# Altium schematic sheet B2B_Connectors.SchDoc: B2B Connector
size A4; Organization: Trenz Electronic GmbH; DocumentNumber: TE0706; Revision: 02; SheetNumber: 2; SheetTotal: 10; Date: 2016-06-28; Author: Vitali Tsiukala; DrawnBy: Vitali Tsiukala; Engineer: Vitali Tsiukala; PageSetup: Record=PageOptions|CenterHorizontal=True|CenterVertical=True|PrintScale=0.97|XCorrection=1.00|YCorrection=1.00|PrintKind=0|BorderSize=5000000|LeftOffset=0|BottomOffset=0|Orientation=2|PaperLength=2970|PaperWidth=2100|Scale=100|PaperSource=7|PrintQuality=600|MediaType=1|DitherType=10|PrintScaleMode=1|PaperKind=A4|PaperIndex=9
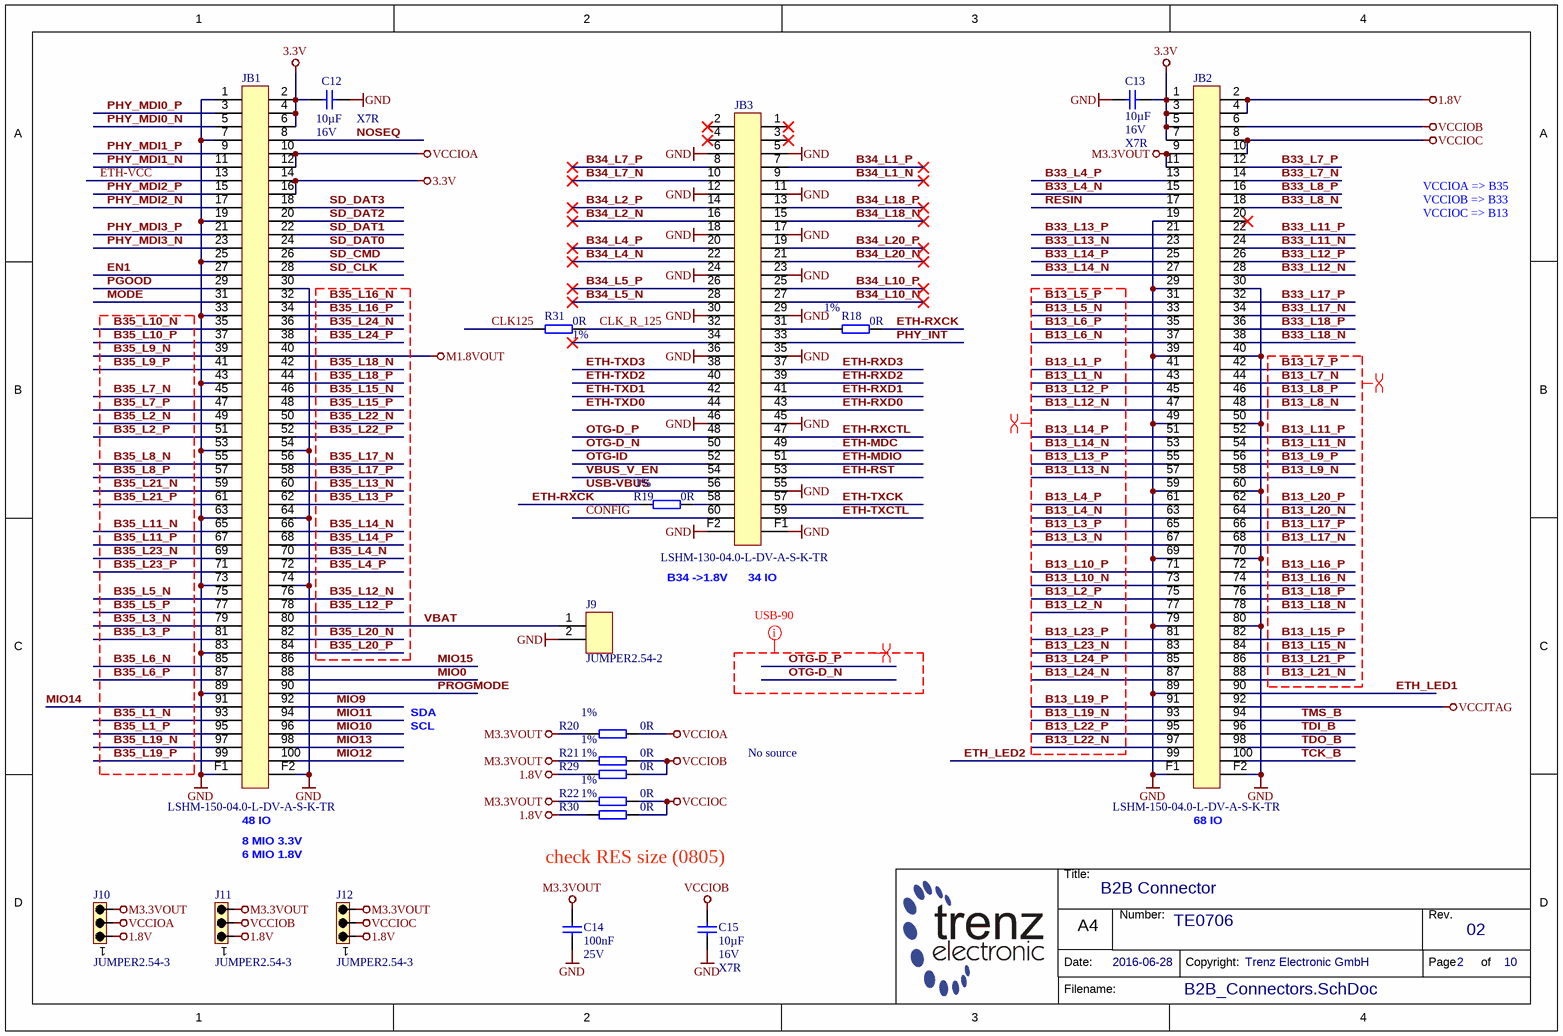
[diagram p0: B2B_Connectors.SchDoc]

## Parts
C12  10µF  Voltage: 16V  Technology: X7R  [CAPC2012X135N]
C13  10µF  Voltage: 16V  Technology: X7R  [CAPC2012X135N]
C14  100nF  Voltage: 25V  [CAPC1005X55N]
C15  10µF  Voltage: 16V  Technology: X7R  [CAPC2012X135N]
J9  JUMPER2.54-2  [JUMPER2_54-2]
J10  JUMPER2.54-3  [JUMPER2_54-3]
J11  JUMPER2.54-3  [JUMPER2_54-3]
J12  JUMPER2.54-3  [JUMPER2_54-3]
JB1  LSHM-150-04.0-L-DV-A-S-K-TR  [LSHM-150-XXX-X-DV-A-X]
JB2  LSHM-150-04.0-L-DV-A-S-K-TR  [LSHM-150-XXX-X-DV-A-X]
JB3  LSHM-130-04.0-L-DV-A-S-K-TR  [LSHM-130-04.0-x-DV-A-S-K-TR]
R18  0R  Tolerance: 1%  [RESC1005X40N]
R19  0R  Tolerance: 1%  [RESC1005X40N]
R20  0R  Tolerance: 1%  [RESC2012X60N]
R21  0R  Tolerance: 1%  [RESC2012X60N]
R22  0R  Tolerance: 1%  [RESC2012X60N]
R29  0R  Tolerance: 1%  [RESC2012X60N]
R30  0R  Tolerance: 1%  [RESC2012X60N]
R31  0R  Tolerance: 1%  [RESC1005X40N]

## Nets
1.8V: J10.1 J11.1 J12.1 JB2.2 JB2.4 R29.1 R30.1
3.3V: C12.2 C13.2 JB1.2 JB1.4 JB1.6 JB1.14 JB1.16 JB2.1 JB2.3 JB2.5 JB2.7
GND: C12.1 C13.1 C14.2 C15.1 J9.2 JB1.1 JB1.7 JB1.19 JB1.25 JB1.30 JB1.33 JB1.43 JB1.53 JB1.54 JB1.63 JB1.64 JB1.73 JB1.74 JB1.83 JB1.89 JB1.F1(Shield) JB1.F2(Shield) JB2.19 JB2.29 JB2.30 JB2.39 JB2.40 JB2.49 JB2.50 JB2.59 JB2.60 JB2.69 JB2.70 JB2.79 JB2.80 JB2.89 JB2.F1(Shield) JB2.F2(Shield) JB3.5 JB3.6 JB3.11 JB3.12 JB3.17 JB3.18 JB3.23 JB3.24 JB3.29 JB3.30 JB3.35 JB3.36 JB3.45 JB3.46 JB3.55 JB3.F1(Shield) JB3.F2(Shield)
M1.8VOUT: JB1.40
M3.3VOUT: C14.1 J10.3 J11.3 J12.3 JB2.9 JB2.11 R20.1 R21.1 R22.1
VCCIOA: J10.2 JB1.10 JB1.12 R20.2
VCCIOB: C15.2 J11.2 JB2.6 R21.2 R29.2
VCCIOC: J12.2 JB2.8 JB2.10 R22.2 R30.2
VCCJTAG: JB2.92
B13_L1_N: JB2.43
B13_L1_P: JB2.41
B13_L2_N: JB2.77
B13_L2_P: JB2.75
B13_L3_N: JB2.67
B13_L3_P: JB2.65
B13_L4_N: JB2.63
B13_L4_P: JB2.61
B13_L5_N: JB2.33
B13_L5_P: JB2.31
B13_L6_N: JB2.37
B13_L6_P: JB2.35
B13_L7_N: JB2.44
B13_L7_P: JB2.42
B13_L8_N: JB2.48
B13_L8_P: JB2.46
B13_L9_N: JB2.58
B13_L9_P: JB2.56
B13_L10_N: JB2.73
B13_L10_P: JB2.71
B13_L11_N: JB2.54
B13_L11_P: JB2.52
B13_L12_N: JB2.47
B13_L12_P: JB2.45
B13_L13_N: JB2.57
B13_L13_P: JB2.55
B13_L14_N: JB2.53
B13_L14_P: JB2.51
B13_L15_N: JB2.84
B13_L15_P: JB2.82
B13_L16_N: JB2.74
B13_L16_P: JB2.72
B13_L17_N: JB2.68
B13_L17_P: JB2.66
B13_L18_N: JB2.78
B13_L18_P: JB2.76
B13_L19_N: JB2.93
B13_L19_P: JB2.91
B13_L20_N: JB2.64
B13_L20_P: JB2.62
B13_L21_N: JB2.88
B13_L21_P: JB2.86
B13_L22_N: JB2.97
B13_L22_P: JB2.95
B13_L23_N: JB2.83
B13_L23_P: JB2.81
B13_L24_N: JB2.87
B13_L24_P: JB2.85
B33_L4_N: JB2.15
B33_L4_P: JB2.13
B33_L7_N: JB2.14
B33_L7_P: JB2.12
B33_L8_N: JB2.18
B33_L8_P: JB2.16
B33_L11_N: JB2.24
B33_L11_P: JB2.22
B33_L12_N: JB2.28
B33_L12_P: JB2.26
B33_L13_N: JB2.23
B33_L13_P: JB2.21
B33_L14_N: JB2.27
B33_L14_P: JB2.25
B33_L17_N: JB2.34
B33_L17_P: JB2.32
B33_L18_N: JB2.38
B33_L18_P: JB2.36
B34_L1_N: JB3.9
B34_L1_P: JB3.7
B34_L2_N: JB3.16
B34_L2_P: JB3.14
B34_L4_N: JB3.22
B34_L4_P: JB3.20
B34_L5_N: JB3.28
B34_L5_P: JB3.26
B34_L7_N: JB3.10
B34_L7_P: JB3.8
B34_L10_N: JB3.27
B34_L10_P: JB3.25
B34_L18_N: JB3.15
B34_L18_P: JB3.13
B34_L20_N: JB3.21
B34_L20_P: JB3.19
B35_L1_N: JB1.93
B35_L1_P: JB1.95
B35_L2_N: JB1.49
B35_L2_P: JB1.51
B35_L3_N: JB1.79
B35_L3_P: JB1.81
B35_L4_N: JB1.70
B35_L4_P: JB1.72
B35_L5_N: JB1.75
B35_L5_P: JB1.77
B35_L6_N: JB1.85
B35_L6_P: JB1.87
B35_L7_N: JB1.45
B35_L7_P: JB1.47
B35_L8_N: JB1.55
B35_L8_P: JB1.57
B35_L9_N: JB1.39
B35_L9_P: JB1.41
B35_L10_N: JB1.35
B35_L10_P: JB1.37
B35_L11_N: JB1.65
B35_L11_P: JB1.67
B35_L12_N: JB1.76
B35_L12_P: JB1.78
B35_L13_N: JB1.60
B35_L13_P: JB1.62
B35_L14_N: JB1.66
B35_L14_P: JB1.68
B35_L15_N: JB1.46
B35_L15_P: JB1.48
B35_L16_N: JB1.32
B35_L16_P: JB1.34
B35_L17_N: JB1.56
B35_L17_P: JB1.58
B35_L18_N: JB1.42
B35_L18_P: JB1.44
B35_L19_N: JB1.97
B35_L19_P: JB1.99
B35_L20_N: JB1.82
B35_L20_P: JB1.84
B35_L21_N: JB1.59
B35_L21_P: JB1.61
B35_L22_N: JB1.50
B35_L22_P: JB1.52
B35_L23_N: JB1.69
B35_L23_P: JB1.71
B35_L24_N: JB1.36
B35_L24_P: JB1.38
CLK125: R31.1
CLK_R_125: JB3.32 R31.2
CONFIG: JB3.60
EN1: JB1.27
ETH-MDC: JB3.49
ETH-MDIO: JB3.51
ETH-RST: JB3.53
ETH-RXCK: R18.2 R19.1
ETH-RXCTL: JB3.47
ETH-RXD0: JB3.43
ETH-RXD1: JB3.41
ETH-RXD2: JB3.39
ETH-RXD3: JB3.37
ETH-TXCK: JB3.57
ETH-TXCTL: JB3.59
ETH-TXD0: JB3.44
ETH-TXD1: JB3.42
ETH-TXD2: JB3.40
ETH-TXD3: JB3.38
ETH-VCC: JB1.13
ETH_LED1: JB2.90
ETH_LED2: JB2.99
MIO0: JB1.88
MIO9: JB1.92
MIO10: JB1.96
MIO11: JB1.94
MIO12: JB1.100
MIO13: JB1.98
MIO14: JB1.91
MIO15: JB1.86
MODE: JB1.31
NOSEQ: JB1.8
OTG-D_N: JB3.50
OTG-D_P: JB3.48
OTG-ID: JB3.52
PGOOD: JB1.29
PHY_INT: JB3.33
PHY_MDI0_N: JB1.5
PHY_MDI0_P: JB1.3
PHY_MDI1_N: JB1.11
PHY_MDI1_P: JB1.9
PHY_MDI2_N: JB1.17
PHY_MDI2_P: JB1.15
PHY_MDI3_N: JB1.23
PHY_MDI3_P: JB1.21
PROGMODE: JB1.90
RESIN: JB2.17
SD_CLK: JB1.28
SD_CMD: JB1.26
SD_DAT0: JB1.24
SD_DAT1: JB1.22
SD_DAT2: JB1.20
SD_DAT3: JB1.18
TCK_B: JB2.100
TDI_B: JB2.96
TDO_B: JB2.98
TMS_B: JB2.94
USB-VBUS: JB3.56
VBAT: J9.1 JB1.80
VBUS_V_EN: JB3.54
NetJB3_31: JB3.31 R18.1
NetJB3_58: JB3.58 R19.2

Not connected (* = marked no-connect by the designer): JB2 20*; JB3 1* 2* 3* 4* 34*

## Layout directives
differential pair: B13_L1_N, B13_L1_P, B13_L2_N, B13_L2_P, B13_L3_N, B13_L3_P, B13_L4_N, B13_L4_P, B13_L5_N, B13_L5_P, B13_L6_N, B13_L6_P, B13_L7_N, B13_L7_P, B13_L8_N, B13_L8_P, B13_L9_N, B13_L9_P, B13_L10_N, B13_L10_P, B13_L11_N, B13_L11_P, B13_L12_N, B13_L12_P, B13_L13_N, B13_L13_P, B13_L14_N, B13_L14_P, B13_L15_N, B13_L15_P, B13_L16_N, B13_L16_P, B13_L17_N, B13_L17_P, B13_L18_N, B13_L18_P, B13_L19_N, B13_L19_P, B13_L20_N, B13_L20_P, B13_L21_N, B13_L21_P, B13_L22_N, B13_L22_P, B13_L23_N, B13_L23_P, B13_L24_N, B13_L24_P, OTG-D_N, OTG-D_P
net class USB-90: OTG-D_N, OTG-D_P

## Notes on the sheet
- VCCIOB => B33
- VCCIOC => B13
- VCCIOA => B35
- B34 ->1.8V
- (near JB3) 34 IO
- SDA
- SCL
- No source
- (near JB1) 48 IO
- 8 MIO 3.3V
- (near JB2) 68 IO
- 6 MIO 1.8V
- check RES size (0805)
- Title:
- Number:
- Rev.
- Date:
- A4
- Copyright:
- Page
- of
- Filename:

## Library data of the parts
C12 C13 C15 = 24380: KON 10µF 16V X7R SMD 10%; AN: 24380; Value: 10u; Mixed: SMT; Preferred: Yes; Case: 2012 (0805); Tolerance: 10%
C14 = 22472: KON 100nF 25V X5R SMD; AN: 22472; Mixed: SMT; Value: 100n; Preferred: Yes; Technology: X7R; Case: 1005 (0402)
J9 = 27212: Stiftleiste gerade 1-reihig, 2pol.; AN: 27212; Mixed: THT; Trenz-Stock: Yes
J10-J12 = 22328: Stiftleiste gerade 1-reihig, 3pol.; AN: 22328; Mixed: THT; Trenz-Stock: Yes
JB1 JB2 = 23838: Samtec Razor Beam REF⁃189016⁃02, LF-04.0, 100 Pins, für alle 4x5 SoMs; AN: 23838; Trenz-Stock: Yes; Mixed: SMT; HelpURL: B:\AD\adlib\datasheet\LSHM-1XX-XX-XXX-DV-A; Preferred: Yes; H-ART: REF⁃189016⁃02
JB3 = 24903: Samtec Razor Beam REF⁃189017⁃02, LF-04.0, 60 Pins, für alle 4x5 SoMs; AN: 24903; Trenz-Stock: Yes; Mixed: SMT; HelpURL: B:\AD\adlib\datasheet\LSHM-1XX-XX-XXX-DV-A; H-ART: REF⁃189017⁃02
R18 R19 R31 = 22738: WID SMD 0R; AN: 22738; Mixed: SMT; Value: 0; Preferred: Yes; Case: 1005 (0402); Technology: TK100
R20-R22 R29 R30 = 23415: WID SMD 0R 0.125W 2A Brücke; AN: 23415; Mixed: SMT; Value: 0; Preferred: Yes; Case: 2012 (0805); Technology: TK100